# Altium schematic sheet MCU.SchDoc
size A4; Organization: Altium Limited; Address1: L3, 12a Rodborough Rd; Address2: Frenchs Forest; Address3: NSW; Address4: Australia 2086; DocumentNumber: 4; SheetNumber: 4; SheetTotal: 5
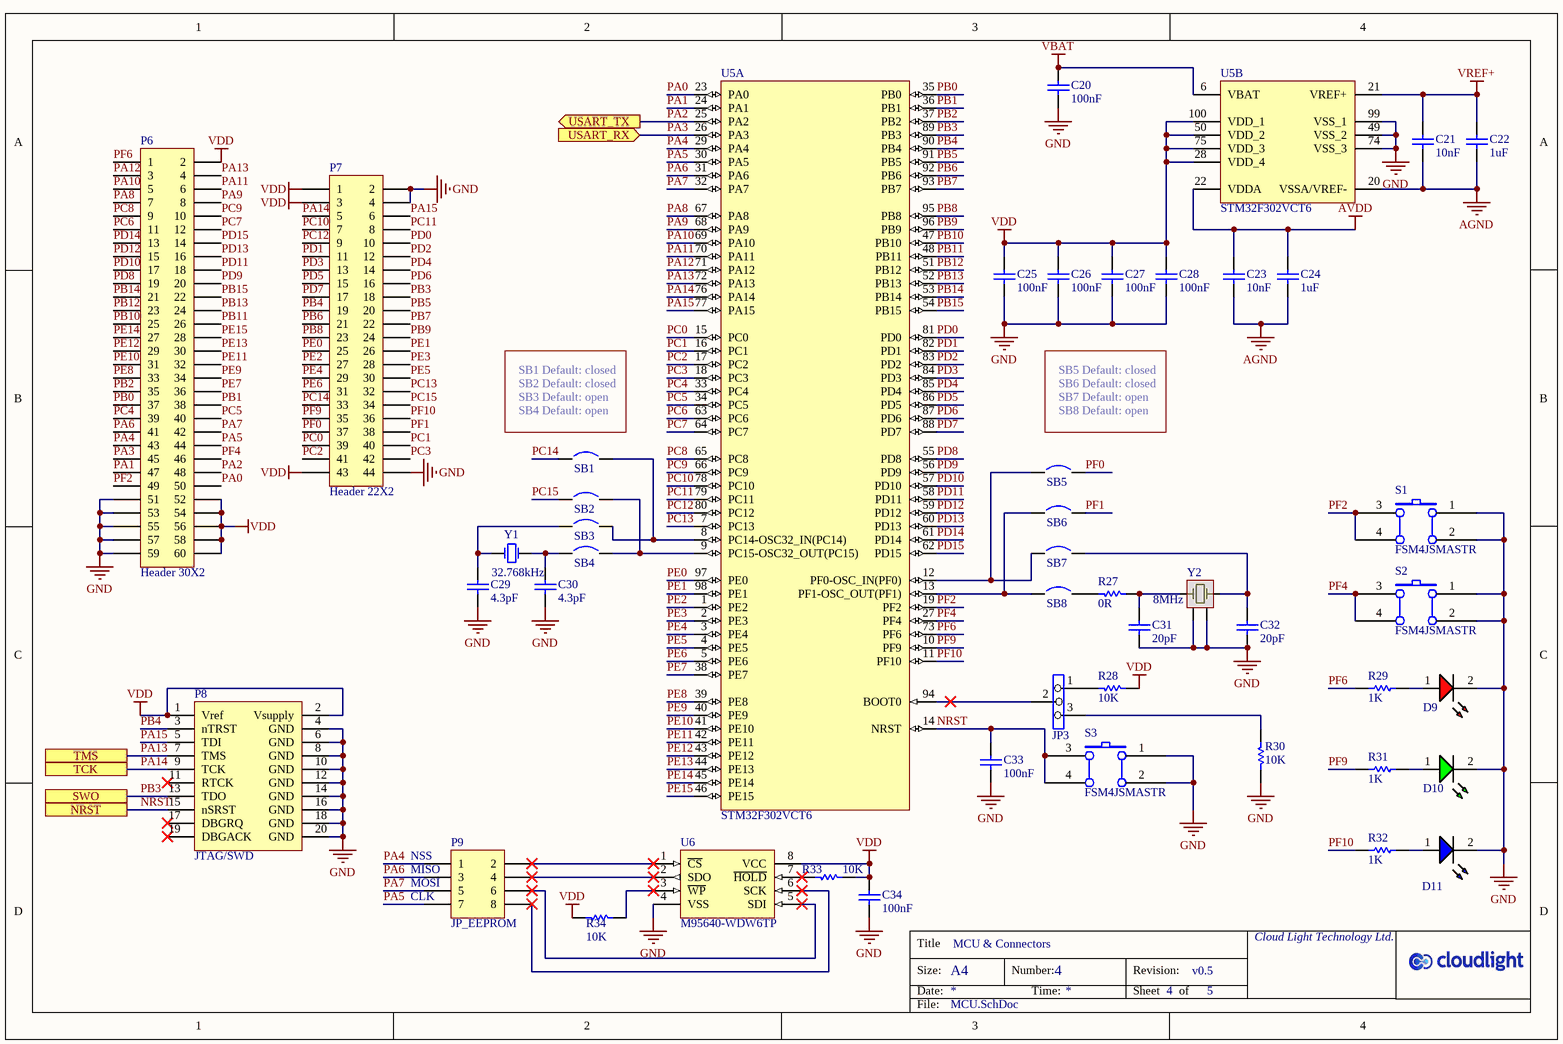
[diagram p0: MCU.SchDoc]

## Parts
C20  100nF  [CAPC1608N]
C21  10nF  [CAPC1608N]
C22  1uF  [CAPC1608N]
C23  10nF  [CAPC1608N]
C24  1uF  [CAPC1608N]
C25  100nF  [CAPC1608N]
C26  100nF  [CAPC1608N]
C27  100nF  [CAPC1608N]
C28  100nF  [CAPC1608N]
C29  4.3pF  [CAPC1608N]
C30  4.3pF  [CAPC1608N]
C31  20pF  [CAPC1608N]
C32  20pF  [CAPC1608N]
C33  100nF  [CAPC1608N]
C34  100nF  [CAPC1608N]
D9  LED-SMD0603-R  [CD1608-0603]  (value not drawn)
D10  LED-SMD0603-G  [CD1608-0603]  (value not drawn)
D11  LED-SMD0603-B  [CD1608-0603]  (value not drawn)
JP3  JP3  [SIP3/2.54]  (value not drawn)
P6  Header 30X2  [HDR2X30]
P7  Header 22X2  [HDR2X22]
P8  JTAG/SWD  [HDR2X10/T2.54/B2C]
P9  JP_EEPROM  [HDR2X4]
R27  0R  [RESC1608N]
R28  10K  [RESC1608N]
R29  1K  [RESC1608N]
R30  10K  [RESC1608N]
R31  1K  [RESC1608N]
R32  1K  [RESC1608N]
R33  10K  [RESC1608N]
R34  10K  [RESC1608N]
S1  FSM4JSMASTR  [SW_4PIN_S_6.0X6.0MM]
S2  FSM4JSMASTR  [SW_4PIN_S_6.0X6.0MM]
S3  FSM4JSMASTR  [SW_4PIN_S_6.0X6.0MM]
SB1  Circuit Breaker  [JP2_SMD]  (value not drawn)  (no BOM)
SB2  Circuit Breaker  [JP2_SMD]  (value not drawn)  (no BOM)
SB3  Circuit Breaker  [JP2_SMD]  (value not drawn)  (no BOM)
SB4  Circuit Breaker  [JP2_SMD]  (value not drawn)  (no BOM)
SB5  Circuit Breaker  [JP2_SMD]  (value not drawn)  (no BOM)
SB6  Circuit Breaker  [JP2_SMD]  (value not drawn)  (no BOM)
SB7  Circuit Breaker  [JP2_SMD]  (value not drawn)  (no BOM)
SB8  Circuit Breaker  [JP2_SMD]  (value not drawn)  (no BOM)
U5  STM32F302VCT6  [STM-LQFP100_N]  (parts A,B of 2)
U6  M95640-WDW6TP  [TSOP65P640X120-8N]
Y1  32.768kHz  [FC-12M]
Y2  8MHz  [12SMX-B-N]

## Ports
NRST, SWO, TCK, TMS, USART_RX (in), USART_TX (out)

## Nets
AGND: C21.1 C22.1 C23.1 C24.1 U5.20(VSSA/VREF-)
AVDD: C23.2 C24.2 U5.22(VDDA)
GND: C20.1 C25.1 C26.1 C27.1 C28.1 C29.1 C30.1 C31.1 C32.1 C33.1 C34.1 D9.2(RK) D10.2(RK) D11.2(RK) P6.51 P6.53 P6.55 P6.57 P6.59 P7.2 P7.4 P7.44 P8.4(GND) P8.6(GND) P8.8(GND) P8.10(GND) P8.12(GND) P8.14(GND) P8.16(GND) P8.18(GND) P8.20(GND) R30.2 S1.1 S1.2 S2.1 S2.2 S3.1 S3.2 U5.49(VSS_2) U5.74(VSS_3) U5.99(VSS_1) U6.4(VSS) Y2.2(GND) Y2.4(GND)
VBAT: C20.2 U5.6(VBAT)
VDD: C25.2 C26.2 C27.2 C28.2 C34.2 P6.2 P6.52 P6.54 P6.56 P6.58 P6.60 P7.1 P7.3 P7.43 P8.1(Vref) P8.2(Vsupply) R28.2 R33.2 R34.1 U5.28(VDD_4) U5.50(VDD_2) U5.75(VDD_3) U5.100(VDD_1) U6.8(VCC)
VREF+: C21.2 C22.2 U5.21(VREF+)
NRST: C33.2 P8.15(nSRST) S3.3 S3.4 U5.14(NRST) ; port NRST
PA0: P6.50 U5.23(PA0)
PA1: P6.47 U5.24(PA1)
PA2: P6.48 U5.25(PA2) ; port USART_TX
PA3: P6.45 U5.26(PA3) ; port USART_RX
PA4: P6.43 P9.1 U5.29(PA4)
PA5: P6.44 P9.7 U5.30(PA5)
PA6: P6.41 P9.3 U5.31(PA6)
PA7: P6.42 P9.5 U5.32(PA7)
PA8: P6.7 U5.67(PA8)
PA9: P6.8 U5.68(PA9)
PA10: P6.5 U5.69(PA10)
PA11: P6.6 U5.70(PA11)
PA12: P6.3 U5.71(PA12)
PA13: P6.4 P8.7(TMS) U5.72(PA13) ; port TMS
PA14: P7.5 P8.9(TCK) U5.76(PA14) ; port TCK
PA15: P7.6 P8.5(TDI) U5.77(PA15)
PB0: P6.37 U5.35(PB0)
PB1: P6.38 U5.36(PB1)
PB2: P6.35 U5.37(PB2)
PB3: P7.18 P8.13(TDO) U5.89(PB3) ; port SWO
PB4: P7.19 P8.3(nTRST) U5.90(PB4)
PB5: P7.20 U5.91(PB5)
PB6: P7.21 U5.92(PB6)
PB7: P7.22 U5.93(PB7)
PB8: P7.23 U5.95(PB8)
PB9: P7.24 U5.96(PB9)
PB10: P6.25 U5.47(PB10)
PB11: P6.26 U5.48(PB11)
PB12: P6.23 U5.51(PB12)
PB13: P6.24 U5.52(PB13)
PB14: P6.21 U5.53(PB14)
PB15: P6.22 U5.54(PB15)
PC0: P7.39 U5.15(PC0)
PC1: P7.40 U5.16(PC1)
PC2: P7.41 U5.17(PC2)
PC3: P7.42 U5.18(PC3)
PC4: P6.39 U5.33(PC4)
PC5: P6.40 U5.34(PC5)
PC6: P6.11 U5.63(PC6)
PC7: P6.12 U5.64(PC7)
PC8: P6.9 U5.65(PC8)
PC9: P6.10 U5.66(PC9)
PC10: P7.7 U5.78(PC10)
PC11: P7.8 U5.79(PC11)
PC12: P7.9 U5.80(PC12)
PC13: P7.32 U5.7(PC13)
PC14: P7.33 SB1.1
PC15: P7.34 SB2.1
PD0: P7.10 U5.81(PD0)
PD1: P7.11 U5.82(PD1)
PD2: P7.12 U5.83(PD2)
PD3: P7.13 U5.84(PD3)
PD4: P7.14 U5.85(PD4)
PD5: P7.15 U5.86(PD5)
PD6: P7.16 U5.87(PD6)
PD7: P7.17 U5.88(PD7)
PD8: P6.19 U5.55(PD8)
PD9: P6.20 U5.56(PD9)
PD10: P6.17 U5.57(PD10)
PD11: P6.18 U5.58(PD11)
PD12: P6.15 U5.59(PD12)
PD13: P6.16 U5.60(PD13)
PD14: P6.13 U5.61(PD14)
PD15: P6.14 U5.62(PD15)
PE0: P7.25 U5.97(PE0)
PE1: P7.26 U5.98(PE1)
PE2: P7.27 U5.1(PE2)
PE3: P7.28 U5.2(PE3)
PE4: P7.29 U5.3(PE4)
PE5: P7.30 U5.4(PE5)
PE6: P7.31 U5.5(PE6)
PE7: P6.36 U5.38(PE7)
PE8: P6.33 U5.39(PE8)
PE9: P6.34 U5.40(PE9)
PE10: P6.31 U5.41(PE10)
PE11: P6.32 U5.42(PE11)
PE12: P6.29 U5.43(PE12)
PE13: P6.30 U5.44(PE13)
PE14: P6.27 U5.45(PE14)
PE15: P6.28 U5.46(PE15)
PF0: P7.37 SB5.2
PF1: P7.38 SB6.2
PF2: P6.49 S1.3 S1.4 U5.19(PF2)
PF4: P6.46 S2.3 S2.4 U5.27(PF4)
PF6: P6.1 R29.1 U5.73(PF6)
PF9: P7.35 R31.1 U5.10(PF9)
PF10: P7.36 R32.1 U5.11(PF10)
NetC29_2: C29.2 SB3.1 Y1.2(OSC2)
NetC30_2: C30.2 SB4.1 Y1.1(OSC1)
NetC31_2: C31.2 R27.1 Y2.1(OSC1)
NetC32_2: C32.2 SB7.2 Y2.3(OSC2)
NetD9_1: D9.1(RA) R29.2
NetD10_1: D10.1(RA) R31.2
NetD11_1: D11.1(RA) R32.2
NetJP3_1: JP3.1 R28.1
NetJP3_2: JP3.2 U5.94(BOOT0)
NetJP3_3: JP3.3 R30.1
NetP9_2: P9.2 U6.1(~{CS})
NetP9_4: P9.4 U6.2(SDO)
NetP9_6: P9.6 U6.5(SDI)
NetP9_8: P9.8 U6.6(SCK)
NetR27_2: R27.2 SB8.2
NetR33_1: R33.1 U6.7(~{HOLD})
NetR34_2: R34.2 U6.3(~{WP})
NetSB1_2: SB1.2 SB3.2 U5.8(PC14-OSC32_IN(PC14))
NetSB2_2: SB2.2 SB4.2 U5.9(PC15-OSC32_OUT(PC15))
NetSB5_1: SB5.1 SB7.1 U5.12(PF0-OSC_IN(PF0))
NetSB6_1: SB6.1 SB8.1 U5.13(PF1-OSC_OUT(PF1))

Not connected (* = marked no-connect by the designer): P8 11(RTCK)* 17(DBGRQ)* 19(DBGACK)*

## Notes on the sheet
- SB1 Default: closed
- SB2 Default: closed
- SB5 Default: closed
- SB6 Default: closed
- SB3 Default: open
- (near SB1) SB4 Default: open
- SB7 Default: open
- SB8 Default: open
- (near P9) NSS
- (near P9) MISO
- (near P9) MOSI
- (near P9) CLK
- Title
- Size:
- Date:
- A4
- MCU & Connectors
- Number:
- Time:
- Revision:
- Sheet
- 4
- of
- v0.5
- 5
- Cloud Light Technology Ltd.
- File:
- MCU.SchDoc

## Library data of the parts
C20 C25-C28 C33 C34 = Chip Capacitor: Manufacturer: [N/A]; Value: 100nF/16V/X7R/±10%; Revision: V1.0.0; Package: 0603; PackageDescription: 0603 Chip Capacitor; PartNumber: [N/A]; Supplier 1: [N/A]; Supplier Part Number 1: [N/A]; Publisher: Wentao SUN; Published: 16-Apr-2019
C21 C23 = Chip Capacitor: Manufacturer: [N/A]; Value: 10nF/25V/X7R/±20%; Revision: V1.0.0; Package: 0603; PackageDescription: 0603 Chip Capacitor; PartNumber: [N/A]; Supplier 1: [N/A]; Supplier Part Number 1: [N/A]; Publisher: Wentao SUN; Published: 16-Apr-2019
C22 C24 = Chip Capacitor: Manufacturer: [N/A]; Value: 1uF/16V/X7R/±20%; Revision: V1.0.0; Package: 0603; PackageDescription: 0603 Chip Capacitor; PartNumber: [N/A]; Supplier 1: [N/A]; Supplier Part Number 1: [N/A]; Publisher: Wentao SUN; Published: 16-Apr-2019
C29 C30 = Chip Capacitor: Manufacturer: [N/A]; Value: 4.3pF/100V/C0G/±0.25pF; Revision: V1.0.0; Package: 0603; PackageDescription: 0603 Chip Capacitor; PartNumber: [N/A]; Supplier 1: [N/A]; Supplier Part Number 1: [N/A]; Publisher: Wentao SUN; Published: 16-Apr-2019
C31 C32 = Chip Capacitor: Manufacturer: [N/A]; Value: 20pF/100V/C0G/±5%; Revision: V1.0.0; Package: 0603; PackageDescription: 0603 Chip Capacitor; PartNumber: [N/A]; Supplier 1: [N/A]; Supplier Part Number 1: [N/A]; Publisher: Wentao SUN; Published: 16-Apr-2019
D9 = LED-SMD0603-R: Single Color LED Indication, 0603, Red; Manufacturer: [N/A]; ComponentLink1Description: [N/A]; ComponentLink1URL: [N/A]; Package: 0603; PackageDescription: Chip Diode; Body 1.6 x 0.8 mm (LxW typ); PartNumber: [N/A]; Published: 21-Apr-2019; Publisher: Wentao SUN; Supplier 1: [N/A]; Supplier Part Number 1: [N/A]
D10 = LED-SMD0603-G: Single Color LED Indication, 0603, Green; Manufacturer: [N/A]; ComponentLink1Description: [N/A]; ComponentLink1URL: [N/A]; Package: 0603; PackageDescription: Chip Diode; Body 1.6 x 0.8 mm (LxW typ); PartNumber: [N/A]; Published: 21-Apr-2019; Publisher: Wentao SUN; Supplier 1: [N/A]; Supplier Part Number 1: [N/A]
D11 = LED-SMD0603-B: Single Color LED Indication, 0603, Blue; Manufacturer: [N/A]; ComponentLink1Description: [N/A]; ComponentLink1URL: [N/A]; Package: 0603; PackageDescription: Chip Diode; Body 1.6 x 0.8 mm (LxW typ); PartNumber: [N/A]; Published: 21-Apr-2019; Publisher: Wentao SUN; Supplier 1: [N/A]; Supplier Part Number 1: [N/A]
JP3 = JP3: Jumper 3; Manufacturer: [N/A]; PartNumber: [N/A]; Package: HDR3/T2.54/B2B; PackageDescription: Connector; Header; 3 Position; Pitch 2.54mm; Style Board to Board;; Supplier 1: [N/A]; Supplier Part Number 1: [N/A]
P6 = Header 30X2: Header, 30-Pin, Dual row; Manufacturer: [N/A]; LatestRevisionDate: 17-Jul-2002; LatestRevisionNote: Re-released for DXP Platform.; Publisher: Altium Limited; PartNumber: [N/A]; Supplier Part Number 1: [N/A]; Supplier 1: [N/A]; Package: HDR2X30/T2.54/B2B; PackageDescription: Connector; Header; 2X30 Position; Pitch 2.54mm; Style Board to Board;
P7 = Header 22X2: Header, 22-Pin, Dual row; Manufacturer: [N/A]; LatestRevisionDate: 17-Jul-2002; LatestRevisionNote: Re-released for DXP Platform.; Publisher: Altium Limited; PartNumber: [N/A]; Supplier Part Number 1: [N/A]; Supplier 1: [N/A]; Package: HDR2X22/T2.54/B2B; PackageDescription: Connector; Header; 2X22 Position; Pitch 2.54mm; Style Board to Board;
P8 = JTAG: Header, JTAG; Manufacturer: On Shore Technology Inc.; PartNumber: 302-S201; LatestRevisionDate: 17-Apr-2019; LatestRevisionNote: Re-released for DXP Platform.; Publisher: Wentao SUN; Package: HDR2X10/T2.54/B2C; PackageDescription: Connector; Header; 10x2 Position; Pitch 2.54mm; Style Board to Cable;; Supplier 1: Digi-Key; Supplier Part Number 1: ED10524-ND; ComponentLink1Description: Digi-Key; ComponentLink1URL: https://www.digikey.com/products/en?keywords=ED10524-ND
P9 = Header 4X2: Header, 4-Pin, Dual row; Manufacturer: [N/A]; LatestRevisionDate: 17-Jul-2002; LatestRevisionNote: Re-released for DXP Platform.; Publisher: Altium Limited; Package: HDR2X4/T2.54/B2B; PackageDescription: Connector; Header; 2X4 Position; Pitch 2.54mm; Style Board to Board;; Supplier 1: [N/A]; Supplier Part Number 1: [N/A]; PartNumber: [N/A]; ComponentLink1Description: [N/A]; ComponentLink1URL: [N/A]
R27 = Chip Resistor: Manufacturer: [N/A]; Value: 0R/Jumper/0.1W; Published: 16-Apr-2019; Revision: V1.0.0; Publisher: Wentao SUN; Package: 0603; PackageDescription: 0603 Chip Resistor; PartNumber: [N/A]; Supplier 1: [N/A]; Supplier Part Number 1: [N/A]
R28 R30 R33 R34 = Chip Resistor: Manufacturer: [N/A]; Value: 10K/±5%/0.1W; Published: 16-Apr-2019; Revision: V1.0.0; Publisher: Wentao SUN; Package: 0603; PackageDescription: 0603 Chip Resistor; PartNumber: [N/A]; Supplier 1: [N/A]; Supplier Part Number 1: [N/A]
R29 R31 R32 = Chip Resistor: Manufacturer: [N/A]; Value: 1K/±5%/0.1W; Published: 16-Apr-2019; Revision: V1.0.0; Publisher: Wentao SUN; Package: 0603; PackageDescription: 0603 Chip Resistor; PartNumber: [N/A]; Supplier 1: [N/A]; Supplier Part Number 1: [N/A]
S1-S3 = FSM4JSMASTR: Tactile Switch SPST-NO Top Actuated Surface Mount; Manufacturer: TE Connectivity; Package: SW_4PIN_S_6.0X6.0MM; PackageDescription: Surface Mount Switch, 4 Leads, Body 6.0*6.0mm, Pitch 4.5mm/8.4mm; PartNumber: FSM4JSMASTR; Supplier 1: Digi-Key; Supplier Part Number 1: 450-2141-1-ND
SB1-SB8 = Circuit Breaker: Solder: NO; Published: 24-Mar-1999; Revision: July-2002: Re-released for DXP Platform.; Publisher: Altium Limited
U5 = STM32F302VCT6: ARM Cortex-M4 32-bit MCU, 256 KB Flash, 32 KB Internal RAM, 87 I/Os, 100-pin LQFP, -40 to 85 degC, Tray; Manufacturer: STMicroelectronics; D/A Converter: 1x12-bit (1 Channel); FLASH Size (Prog) (kB): 256; I/Os (High Current): 87; Internal RAM Size (kB): 32; Operating Frequency(F) (Processor speed) (MHz): 72; Supply Voltage(Vcc) min (V): 2; DatasheetVersion: Rev. 6; PackageVersion: Rev. 1, 06/2013; PackageReference: LQFP100; PackageDescription: 100-Pin Low Profile Quad Flat Package, 14 x 14 mm Body, 0.5 mm Pitch; Supplier 1: Digi-Key; Supplier Part Number 1: 497-17420-ND; Supplier 2: Farnell; Supplier Part Number 2: 2333253; Supplier 3: Newark; Supplier Part Number 3: 99W9870; Supplier 4: Newark; Supplier Part Number 4: 48W6878; Supplier 5: Mouser; Supplier Part Number 5: 511-STM32F302VCT6; Core: ARM Cortex-M4; Packing: Tray; Mounting Technology: Surface Mount; PartNumber: STM32F302VCT6; ComponentLink1Description: Manufacturer URL; ComponentLink1URL: http://www.st.com/web/en/home.html; ComponentLink2Description: Datasheet; ComponentLink2URL: http://www.st.com/st-web-ui/static/active/en/resource/technical/document/datasheet/DM00058181.pdf; ComponentLink3Description: Package Specification; ComponentLink3URL: http://www.st.com/st-web-ui/static/active/en/resource/technical/document/data_brief/DM00071938.pdf; Package: LQFP100
U6 = M95640-WDW6TP: EEPROM Memory IC 64Kb (8K x 8) SPI 20MHz 8-TSSOP; Manufacturer: STMicroelectronics; Package: 8-TSSOP; PackageDescription: TSOP, 8-Leads, Body 3.00x4.40mm, Pitch 0.65mm; PartNumber: M95640-WDW6TP; Supplier 1: Digi-Key; Supplier Part Number 1: 497-8699-1-ND
Y1 = FC-12M 32.7680KA-A5: 32.768kHz ±20ppm Crystal 12.5pF 90 kOhms 2-SMD, No Lead; Manufacturer: EPSON; Package: FC-12M; PackageDescription: 2-SMD, No Lead, Outline 2.05*1.20mm; PartNumber: FC-12M 32.7680KA-A5; Supplier 1: Digi-Key; Supplier Part Number 1: SER4080CT-ND; Value: 32.768kHz
Y2 = LFXTAL056516REEL: 8MHz ±30ppm Crystal 12pF 80 Ohms 4-SMD, No Lead; Manufacturer: IQD Frequency Product Ltd.; Package: 12SMX-B; PackageDescription: 4-SMD, No Lead; PartNumber: LFXTAL056516REEL; Supplier 1: Digi-Key; Supplier Part Number 1: 1923-1017-1-ND; Value: 8MHz